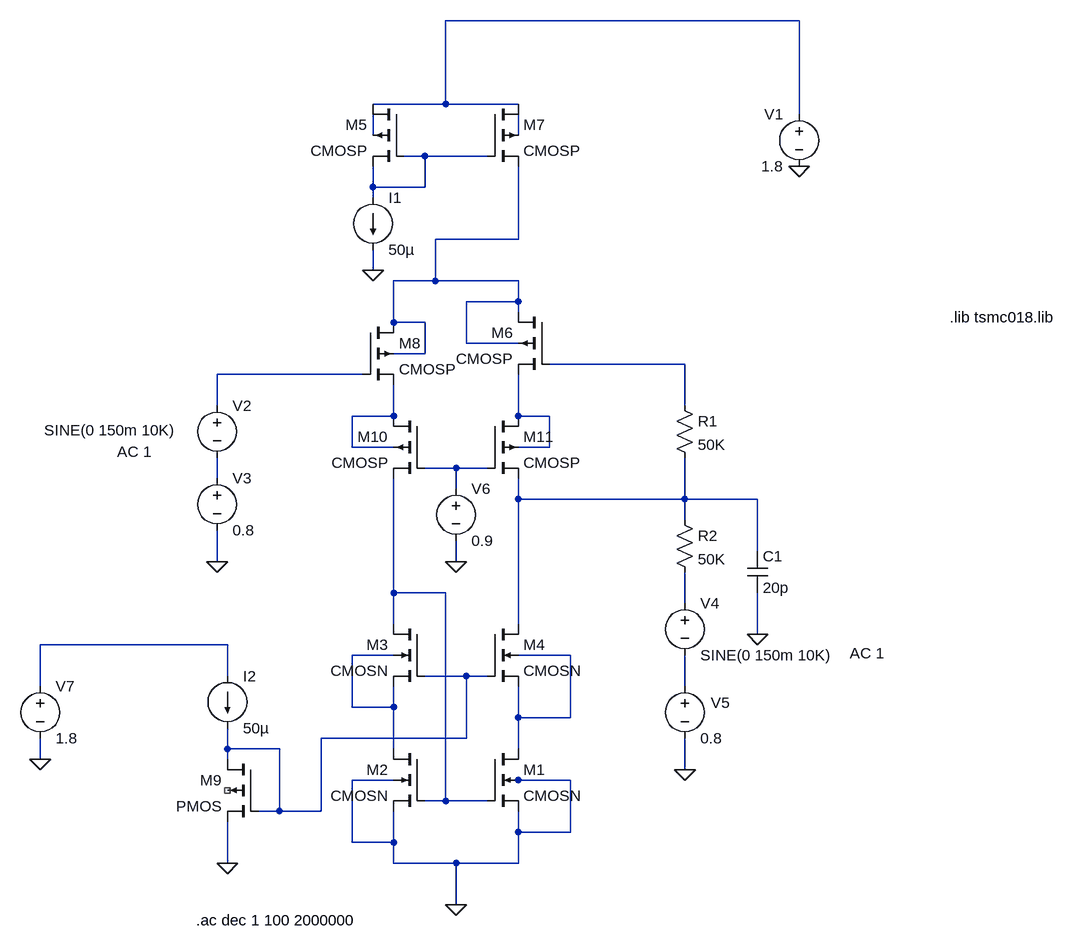
[diagram p0: schematic Draft1.asc]
Draft1.asc, the LTspice schematic file:
Version 4
SHEET 1 1616 1400
WIRE 848 0 304 0
WIRE 304 128 304 0
WIRE 304 128 192 128
WIRE 416 128 304 128
WIRE 848 144 848 0
WIRE 192 176 192 144
WIRE 416 176 416 144
WIRE 272 208 240 208
WIRE 368 208 272 208
WIRE 192 256 192 224
WIRE 272 256 272 208
WIRE 272 256 192 256
WIRE 192 272 192 256
WIRE 416 336 416 224
WIRE 416 336 288 336
WIRE 192 384 192 352
WIRE 288 400 288 336
WIRE 288 400 224 400
WIRE 416 400 288 400
WIRE 416 432 416 400
WIRE 416 432 336 432
WIRE 416 448 416 432
WIRE 224 464 224 400
WIRE 272 464 224 464
WIRE 336 496 336 432
WIRE 416 496 336 496
WIRE 272 512 272 464
WIRE 272 512 224 512
WIRE 672 528 464 528
WIRE 176 544 -48 544
WIRE -48 592 -48 544
WIRE 672 592 672 528
WIRE 224 608 224 560
WIRE 224 608 160 608
WIRE 416 608 416 544
WIRE 464 608 416 608
WIRE 160 656 160 608
WIRE 224 656 160 656
WIRE 464 656 464 608
WIRE 464 656 416 656
WIRE 320 688 272 688
WIRE 368 688 320 688
WIRE -48 704 -48 672
WIRE 320 720 320 688
WIRE 416 736 416 704
WIRE 672 736 672 672
WIRE 672 736 416 736
WIRE 784 736 672 736
WIRE 672 768 672 736
WIRE 784 816 784 736
WIRE -48 832 -48 784
WIRE 320 832 320 800
WIRE 224 880 224 704
WIRE 304 880 224 880
WIRE 672 896 672 848
WIRE 224 928 224 880
WIRE 416 928 416 736
WIRE 784 944 784 880
WIRE -32 960 -320 960
WIRE 224 976 160 976
WIRE 496 976 416 976
WIRE -32 1008 -32 960
WIRE 336 1008 272 1008
WIRE 368 1008 336 1008
WIRE -320 1024 -320 960
WIRE 672 1024 672 976
WIRE 160 1056 160 976
WIRE 224 1056 224 1024
WIRE 224 1056 160 1056
WIRE 416 1072 416 1024
WIRE 496 1072 496 976
WIRE 496 1072 416 1072
WIRE 336 1104 336 1008
WIRE 336 1104 112 1104
WIRE -32 1120 -32 1088
WIRE 48 1120 -32 1120
WIRE 224 1120 224 1056
WIRE 416 1120 416 1072
WIRE -320 1136 -320 1104
WIRE -32 1136 -32 1120
WIRE 672 1152 672 1104
WIRE 224 1168 160 1168
WIRE 416 1168 400 1168
WIRE 496 1168 416 1168
WIRE 304 1200 304 880
WIRE 304 1200 272 1200
WIRE 368 1200 304 1200
WIRE 48 1216 48 1120
WIRE 48 1216 16 1216
WIRE 112 1216 112 1104
WIRE 112 1216 48 1216
WIRE 416 1248 416 1216
WIRE 496 1248 496 1168
WIRE 496 1248 416 1248
WIRE 160 1264 160 1168
WIRE 224 1264 224 1216
WIRE 224 1264 160 1264
WIRE -32 1296 -32 1232
WIRE 224 1296 224 1264
WIRE 320 1296 224 1296
WIRE 416 1296 416 1248
WIRE 416 1296 320 1296
WIRE 320 1360 320 1296
FLAG 848 224 0
FLAG 784 944 0
FLAG 320 1360 0
FLAG 192 384 0
FLAG 672 1152 0
FLAG -48 832 0
FLAG 320 832 0
FLAG -32 1296 0
FLAG -320 1136 0
SYMBOL voltage 848 128 M0
WINDOW 123 0 0 Left 0
WINDOW 39 0 0 Left 0
SYMATTR InstName V1
SYMATTR Value 1.8
SYMBOL voltage -48 576 R0
WINDOW 3 -266 54 Left 2
WINDOW 123 -154 87 Left 2
WINDOW 39 0 0 Left 0
SYMATTR Value SINE(0 150m 10K)
SYMATTR Value2 AC 1
SYMATTR InstName V2
SYMBOL voltage -48 688 R0
WINDOW 123 0 0 Left 0
WINDOW 39 0 0 Left 0
SYMATTR InstName V3
SYMATTR Value 0.8
SYMBOL nmos4 368 1120 R0
SYMATTR InstName M1
SYMATTR Value CMOSN
SYMATTR Value2 l=180nm w=200um
SYMBOL nmos4 272 1120 M0
SYMATTR InstName M2
SYMATTR Value CMOSN
SYMATTR Value2 l=180nm w=200um
SYMBOL nmos4 272 928 M0
SYMATTR InstName M3
SYMATTR Value CMOSN
SYMATTR Value2 l=180nm w=200nm
SYMBOL nmos4 368 928 R0
SYMATTR InstName M4
SYMATTR Value CMOSN
SYMATTR Value2 l=180nm w=200um
SYMBOL pmos4 240 128 M0
SYMATTR InstName M5
SYMATTR Value CMOSP
SYMATTR Value2 l=180nm w=200um
SYMBOL pmos4 464 448 M0
SYMATTR InstName M6
SYMATTR Value CMOSP
SYMATTR Value2 l=180nm w=200um
SYMBOL pmos4 368 128 R0
SYMATTR InstName M7
SYMATTR Value CMOSP
SYMATTR Value2 l=180nm w=200um
SYMBOL current 192 272 R0
WINDOW 123 0 0 Left 0
WINDOW 39 0 0 Left 0
SYMATTR InstName I1
SYMATTR Value 50µ
SYMBOL res 656 576 R0
SYMATTR InstName R1
SYMATTR Value 50K
SYMBOL res 656 752 R0
SYMATTR InstName R2
SYMATTR Value 50K
SYMBOL cap 768 816 R0
SYMATTR InstName C1
SYMATTR Value 20p
SYMBOL pmos4 176 464 R0
SYMATTR InstName M8
SYMATTR Value CMOSP
SYMATTR Value2 l=180nm w=200um
SYMBOL pmos4 272 608 M0
SYMATTR InstName M10
SYMATTR Value CMOSP
SYMATTR Value2 l=180nm w=200um
SYMBOL pmos4 368 608 R0
SYMATTR InstName M11
SYMATTR Value CMOSP
SYMATTR Value2 l=180nm w=200um
SYMBOL voltage 672 880 R0
WINDOW 123 254 93 Left 2
WINDOW 39 0 0 Left 0
SYMATTR Value2 AC 1
SYMATTR InstName V4
SYMATTR Value SINE(0 150m 10K)
SYMBOL voltage 672 1008 R0
WINDOW 0 40 41 Left 2
WINDOW 123 0 0 Left 0
WINDOW 39 0 0 Left 0
SYMATTR InstName V5
SYMATTR Value 0.8
SYMBOL voltage 320 704 R0
WINDOW 123 0 0 Left 0
WINDOW 39 0 0 Left 0
SYMATTR InstName V6
SYMATTR Value 0.9
SYMBOL current -32 1008 R0
WINDOW 123 0 0 Left 0
WINDOW 39 0 0 Left 0
SYMATTR InstName I2
SYMATTR Value 50µ
SYMBOL pmos4 16 1136 M0
SYMATTR InstName M9
SYMBOL voltage -320 1008 R0
WINDOW 123 0 0 Left 0
WINDOW 39 0 0 Left 0
SYMATTR InstName V7
SYMATTR Value 1.8
TEXT 1080 456 Left 2 !.lib tsmc018.lib
TEXT -80 1384 Left 2 !.ac dec 1 100 2000000

The netlist it stands for:
* Draft1.asc
V1 N001 0 1.8
V2 N007 N011 SINE(0 150m 10K) AC 1
V3 N011 0 0.8
M1 N017 N013 0 0 CMOSN l=180nm w=200um
M2 N016 N013 0 0 CMOSN l=180nm w=200um
M3 N013 N018 N016 N016 CMOSN l=180nm w=200nm
M4 N012 N018 N017 N017 CMOSN l=180nm w=200um
M5 N001 N004 N004 N002 CMOSP l=180nm w=200um
M6 N005 N006 N009 N005 CMOSP l=180nm w=200um
M7 N001 N004 N005 N003 CMOSP l=180nm w=200um
I1 N004 0 50µ
R1 N006 N012 50K
R2 N012 N014 50K
C1 N012 0 20p
M8 N005 N007 N008 N005 CMOSP l=180nm w=200um
M10 N008 N010 N013 N008 CMOSP l=180nm w=200um
M11 N009 N010 N012 N009 CMOSP l=180nm w=200um
V4 N014 N019 SINE(0 150m 10K) AC 1
V5 N019 0 0.8
V6 N010 0 0.9
I2 N015 N018 50µ
M9 N018 N018 0 NC_01 PMOS
V7 N015 0 1.8
.model NMOS NMOS
.model PMOS PMOS
.lib standard.mos
.lib tsmc018.lib
.ac dec 1 100 2000000
.backanno
.end